# EAGLE schematic nerd300 (EAGLE 6.4)
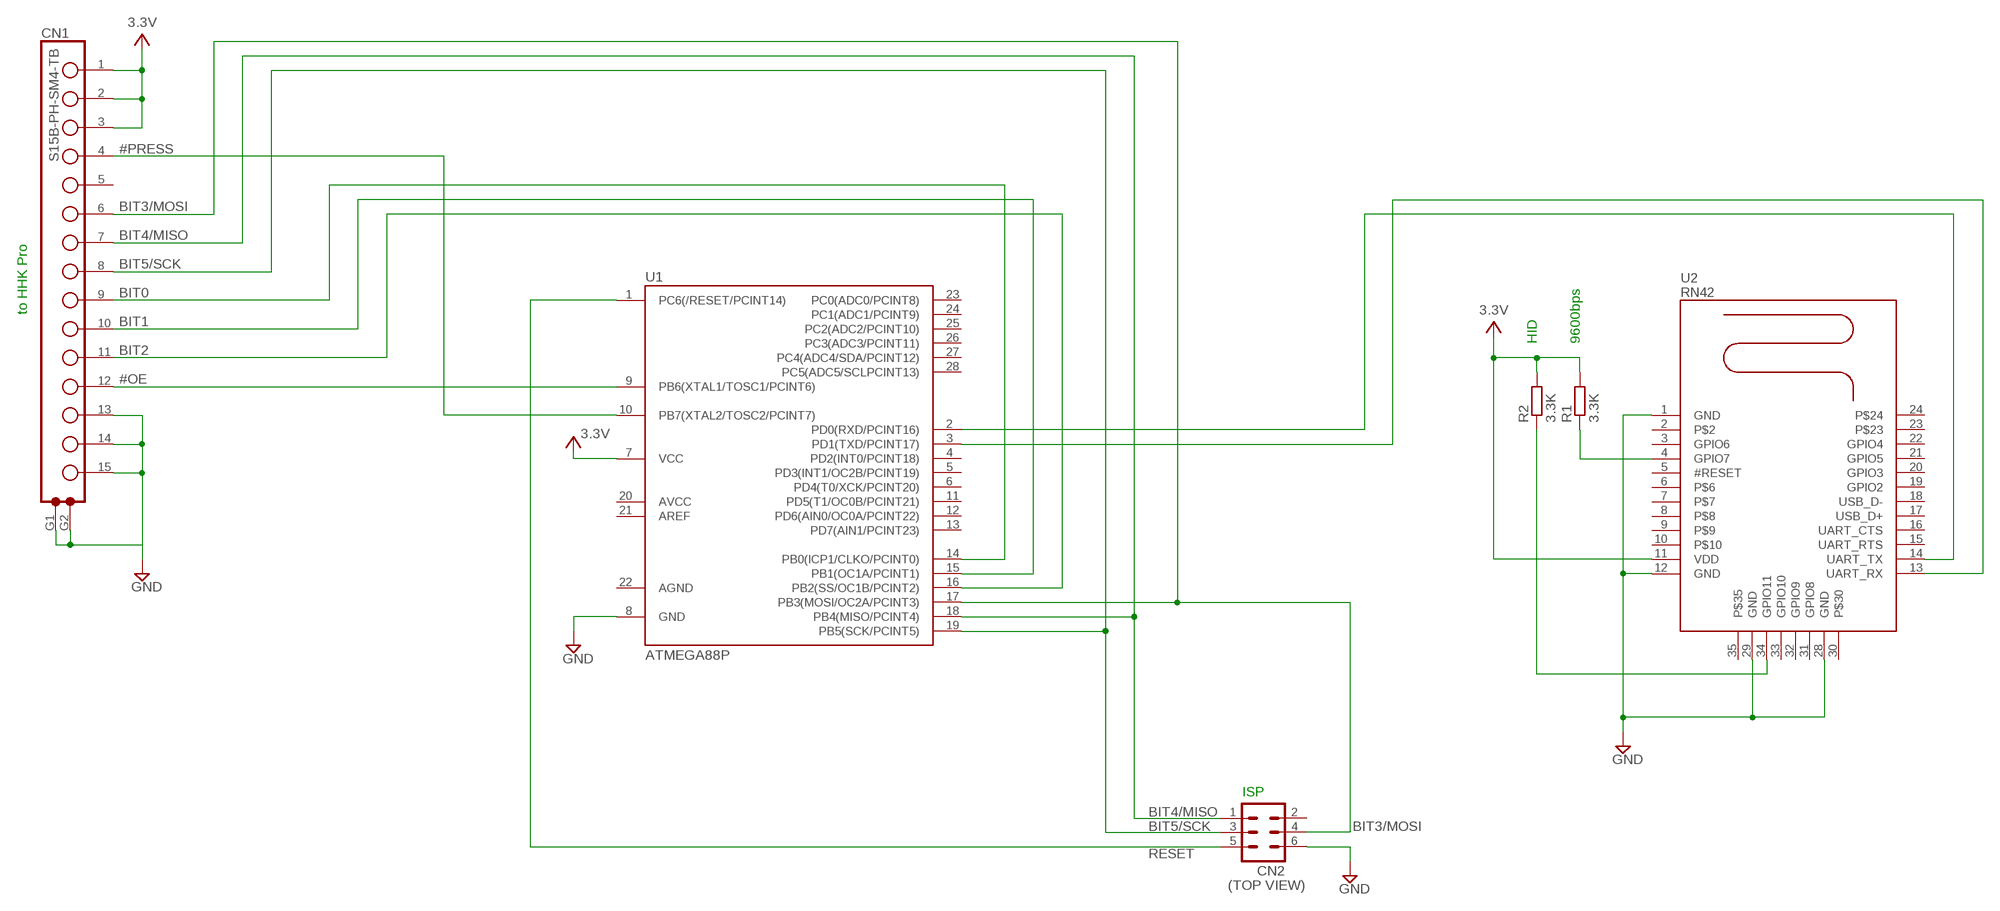
[diagram p0: schematic, sheet 1]

## Parts
CN1  S15B-PH-SM4-TB  S15B-PH-SM-TBS15B-PH-SM4-TB  [S15B-PH-SM*-TB]
CN2  MA03-2  [MA03-2]
R1  3.3K  R-EU_M0805  [M0805]
R2  3.3K  R-EU_M0805  [M0805]
U1  ATMEGA88P  ATMEGA48/88/168-PU  [DIL28-3]
U2  RN42  [RN42]

## Nets
3.3V: CN1.1($1) CN1.2($2) CN1.3($3) R1.2 R2.2 U1.7(VCC) U2.11(VDD) ; supply symbol labelled VCC
#OE: CN1.12($12) U1.9(PB6(XTAL1/TOSC1/PCINT6))
#PRESS: CN1.4($4) U1.10(PB7(XTAL2/TOSC2/PCINT7))
BIT0: CN1.9($9) U1.14(PB0(ICP1/CLKO/PCINT0))
BIT1: CN1.10($10) U1.15(PB1(OC1A/PCINT1))
BIT2: CN1.11($11) U1.16(PB2(SS/OC1B/PCINT2))
BIT3/MOSI: CN1.6($6) CN2.4 U1.17(PB3(MOSI/OC2A/PCINT3))
BIT4/MISO: CN1.7($7) CN2.1 U1.18(PB4(MISO/PCINT4))
BIT5/SCK: CN1.8($8) CN2.3 U1.19(PB5(SCK/PCINT5))
GND: CN1.13($13) CN1.14($14) CN1.15($15) CN1.G1 CN1.G2 CN2.6 U1.8(GND) U2.1(GND) U2.12(GND) U2.28(GND) U2.29(GND)
N$1: R1.1 U2.4(GPIO7)
N$2: R2.1 U2.34(GPIO11)
N$3: U1.2(PD0(RXD/PCINT16)) U2.14(UART_TX)
N$4: U1.3(PD1(TXD/PCINT17)) U2.13(UART_RX)
RESET: CN2.5 U1.1(PC6(/RESET/PCINT14))
Unconnected: CN1.5($5) CN2.2 U1.4(PD2(INT0/PCINT18)) U1.5(PD3(INT1/OC2B/PCINT19)) U1.6(PD4(T0/XCK/PCINT20)) U1.11(PD5(T1/OC0B/PCINT21)) U1.12(PD6(AIN0/OC0A/PCINT22)) U1.13(PD7(AIN1/PCINT23)) U1.20(AVCC) U1.21(AREF) U1.23(PC0(ADC0/PCINT8)) U1.24(PC1(ADC1/PCINT9)) U1.25(PC2(ADC2/PCINT10)) U1.26(PC3(ADC3/PCINT11)) U1.27(PC4(ADC4/SDA/PCINT12)) U1.28(PC5(ADC5/SCLPCINT13)) U2.2 U2.3(GPIO6) U2.5(#RESET) U2.6 U2.7 U2.8 U2.9 U2.10 U2.15(UART_RTS) U2.16(UART_CTS) U2.17(USB_D+) U2.18(USB_D-) U2.19(GPIO2) U2.20(GPIO3) U2.21(GPIO5) U2.22(GPIO4) U2.23 U2.24 U2.30 U2.31(GPIO8) U2.32(GPIO9) U2.33(GPIO10) U2.35

## Notes on the sheet
- to HHK Pro
- HID | 9600bps
- ISP
- (TOP VIEW)

## Power pins joined to a net without a drawn wire
AGND: U1.22(AGND)

## Library data of the parts
CN1 = nerd100:S15B-PH-SM*-TB: connecter header vender: JST pin pitch: 2.0mm pins: 15 angle: right angle mount: SMD
CN2 = con-lstb:MA03-2: PIN HEADER; OC_FARNELL: unknown; OC_NEWARK: unknown
R1 R2 = mylib:R-EU_: RESISTOR, European symbol
U1 = atmega8:ATMEGA48/88/168-PU
U2 = mylib:RN42: ROVING NETWORKS Class 2 Bluetooth Module Bluetooth version 2.1 + Enhanced Data Rate (EDR)